# Altium schematic sheet Sheet1.SchDoc
size A3
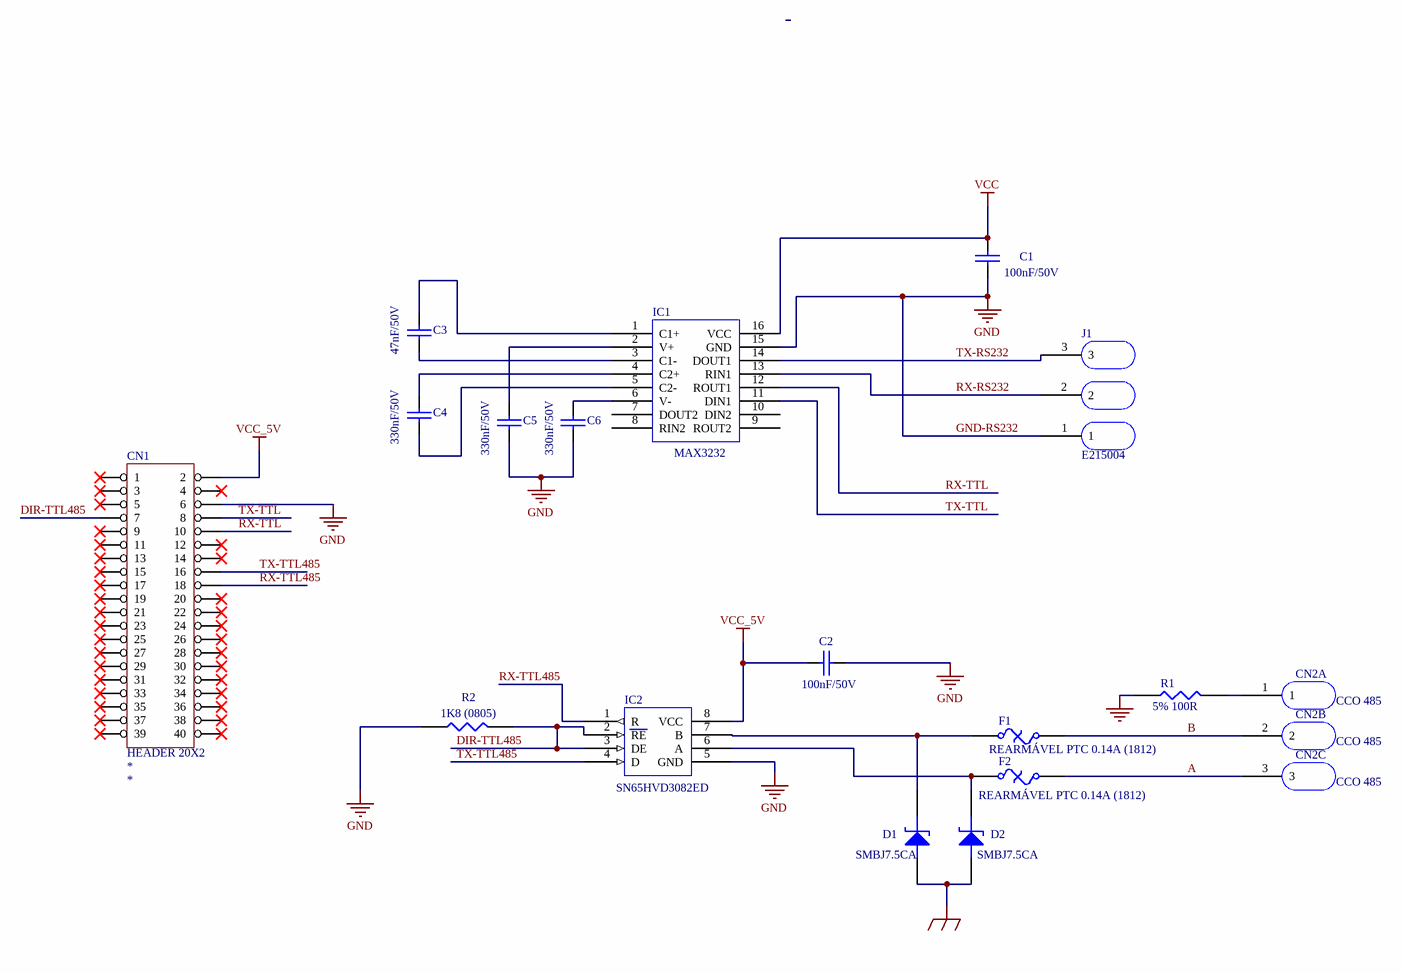
[diagram p0: Sheet1.SchDoc]

## Parts
C1  B217602  [C0805]  (value not drawn)
C2  B217602  [C0805]  (value not drawn)
C3  B217602  [C0805]  (value not drawn)
C4  B217602  [C0805]  (value not drawn)
C5  B217602  [C0805]  (value not drawn)
C6  B217602  [C0805]  (value not drawn)
CN1  HEADER 20X2  [RÉGUA-40PINOS-A+B]
CN2  CCO 485  [MOLEX-3PINOS-MACHO]  (parts A,B,C of 3)
D1  SMBJ7.5CA  [SMB (SMBJ7.5CA)]
D2  SMBJ7.5CA  [SMB (SMBJ7.5CA)]
F1  VALOR: REARMÁVEL PTC 0.14A (1812)  [1812]  (hidden comment: D616404)
F2  VALOR: REARMÁVEL PTC 0.14A (1812)  [1812]  (hidden comment: D616404)
IC1  VALOR: MAX3232  [SOIC-16 (MAX3232)]  (hidden comment: MAX3232 (SOIC-16))
IC2  VALOR: SN65HVD3082ED  [PSOP-8]  (hidden comment: SN65HVD3082)
J1  E215004  [REGUA 3 PINOS_DP2,54MM_FÊMEA]
R1  VALOR: 5% 100R  [R0805]  (hidden comment: B306009)
R2  1K8 (0805)  [R0805]

## Nets
EARTH: D1.2(A) D2.2(A)
GND-RS232: C1.2 C2.2 C5.2 C6.2 CN1.6 IC1.15(GND) IC2.5(GND) J1.1 R1.1 R2.1  [also labelled GND]
VCC: C1.1 IC1.16(VCC)
VCC_5V: C2.1 CN1.2 IC2.8(VCC)
A: CN2.3 F2.2
B: CN2.2 F1.2
DIR-TTL485: CN1.7 IC2.2(RE) IC2.3(DE) R2.2
RX-RS232: IC1.13(RIN1) J1.2
RX-TTL: CN1.10 IC1.12(ROUT1)
RX-TTL485: CN1.18 IC2.1(R)
TX-RS232: IC1.14(DOUT1) J1.3
TX-TTL: CN1.8 IC1.11(DIN1)
TX-TTL485: CN1.16 IC2.4(D)
NetC3_1: C3.1 IC1.1(C1+)
NetC3_2: C3.2 IC1.3(C1-)
NetC4_1: C4.1 IC1.4(C2+)
NetC4_2: C4.2 IC1.5(C2-)
NetC5_1: C5.1 IC1.2(V+)
NetC6_1: C6.1 IC1.6(V-)
NetCN2_1: CN2.1 R1.2
NetD1_1: D1.1(K) F1.1 IC2.7(B)
NetD2_1: D2.1(K) F2.1 IC2.6(A)

Not connected (* = marked no-connect by the designer): CN1 1* 3* 4* 5* 9* 11* 12* 13* 14* 15* 17* 19* 20* 21* 22* 23* 24* 25* 26* 27* 28* 29* 30* 31* 32* 33* 34* 35* 36* 37* 38* 39* 40*; IC1 7(DOUT2) 8(RIN2) 9(ROUT2) 10(DIN2)

## Notes on the sheet
- File:
- Ref:
- Toler.:
- N/A
- Proj.:
- Drw.:
- Apr.:
- Material:
- Date:
- Scale:
- © Copyright
- A3
- Index:
- (in symbol CAP) 100nF/50V; 47nF/50V; 330nF/50V

## Library data of the parts
C1-C6 = CAP: COND. CERAMICO SMD 10% 100NF (0805) 50V
CN1 = HEADER 20X2: RÉGUA DE 40 PINOS MACHO 180G. 2X36P.; E215001: *; (2): *
CN2 = MOLEX MACHO 3 PINOS: CONEC.MOLEX MACHO 6410-03A; Text Field1: CONECTOR MOLEX MACHO - 3 PINOS 6410-03A; E215105: E215105; (2): (2)
D1 D2 = DIODO SMD SMBJ7.5CA: (2): (1); A129603: A129603
F1 F2 = Fuse Thermal: FUSIVEL FUS.LENTA SMD REARMÁVEL PTC 0.14A (1812)
IC1 = MAX3232 (SOIC-16): C.I. SMD MAX3232
IC2 = SN65HVD3082: INTEGRADO 8 PINOS SMD - SN65HVD3082ED
J1 = 3 PINOS ALIMENTA敲O: CONECTOR MOLEX MACHO 6410-03A; (2): (1)
R1 = RESISTENCIA SMD: RESISTÊNCIA SMD
R2 = RESISTENCIA SMD 5% 1K8 (0805): B306004: *; (2): *